# EAGLE schematic Vent Schematic (EAGLE 8.6.0)
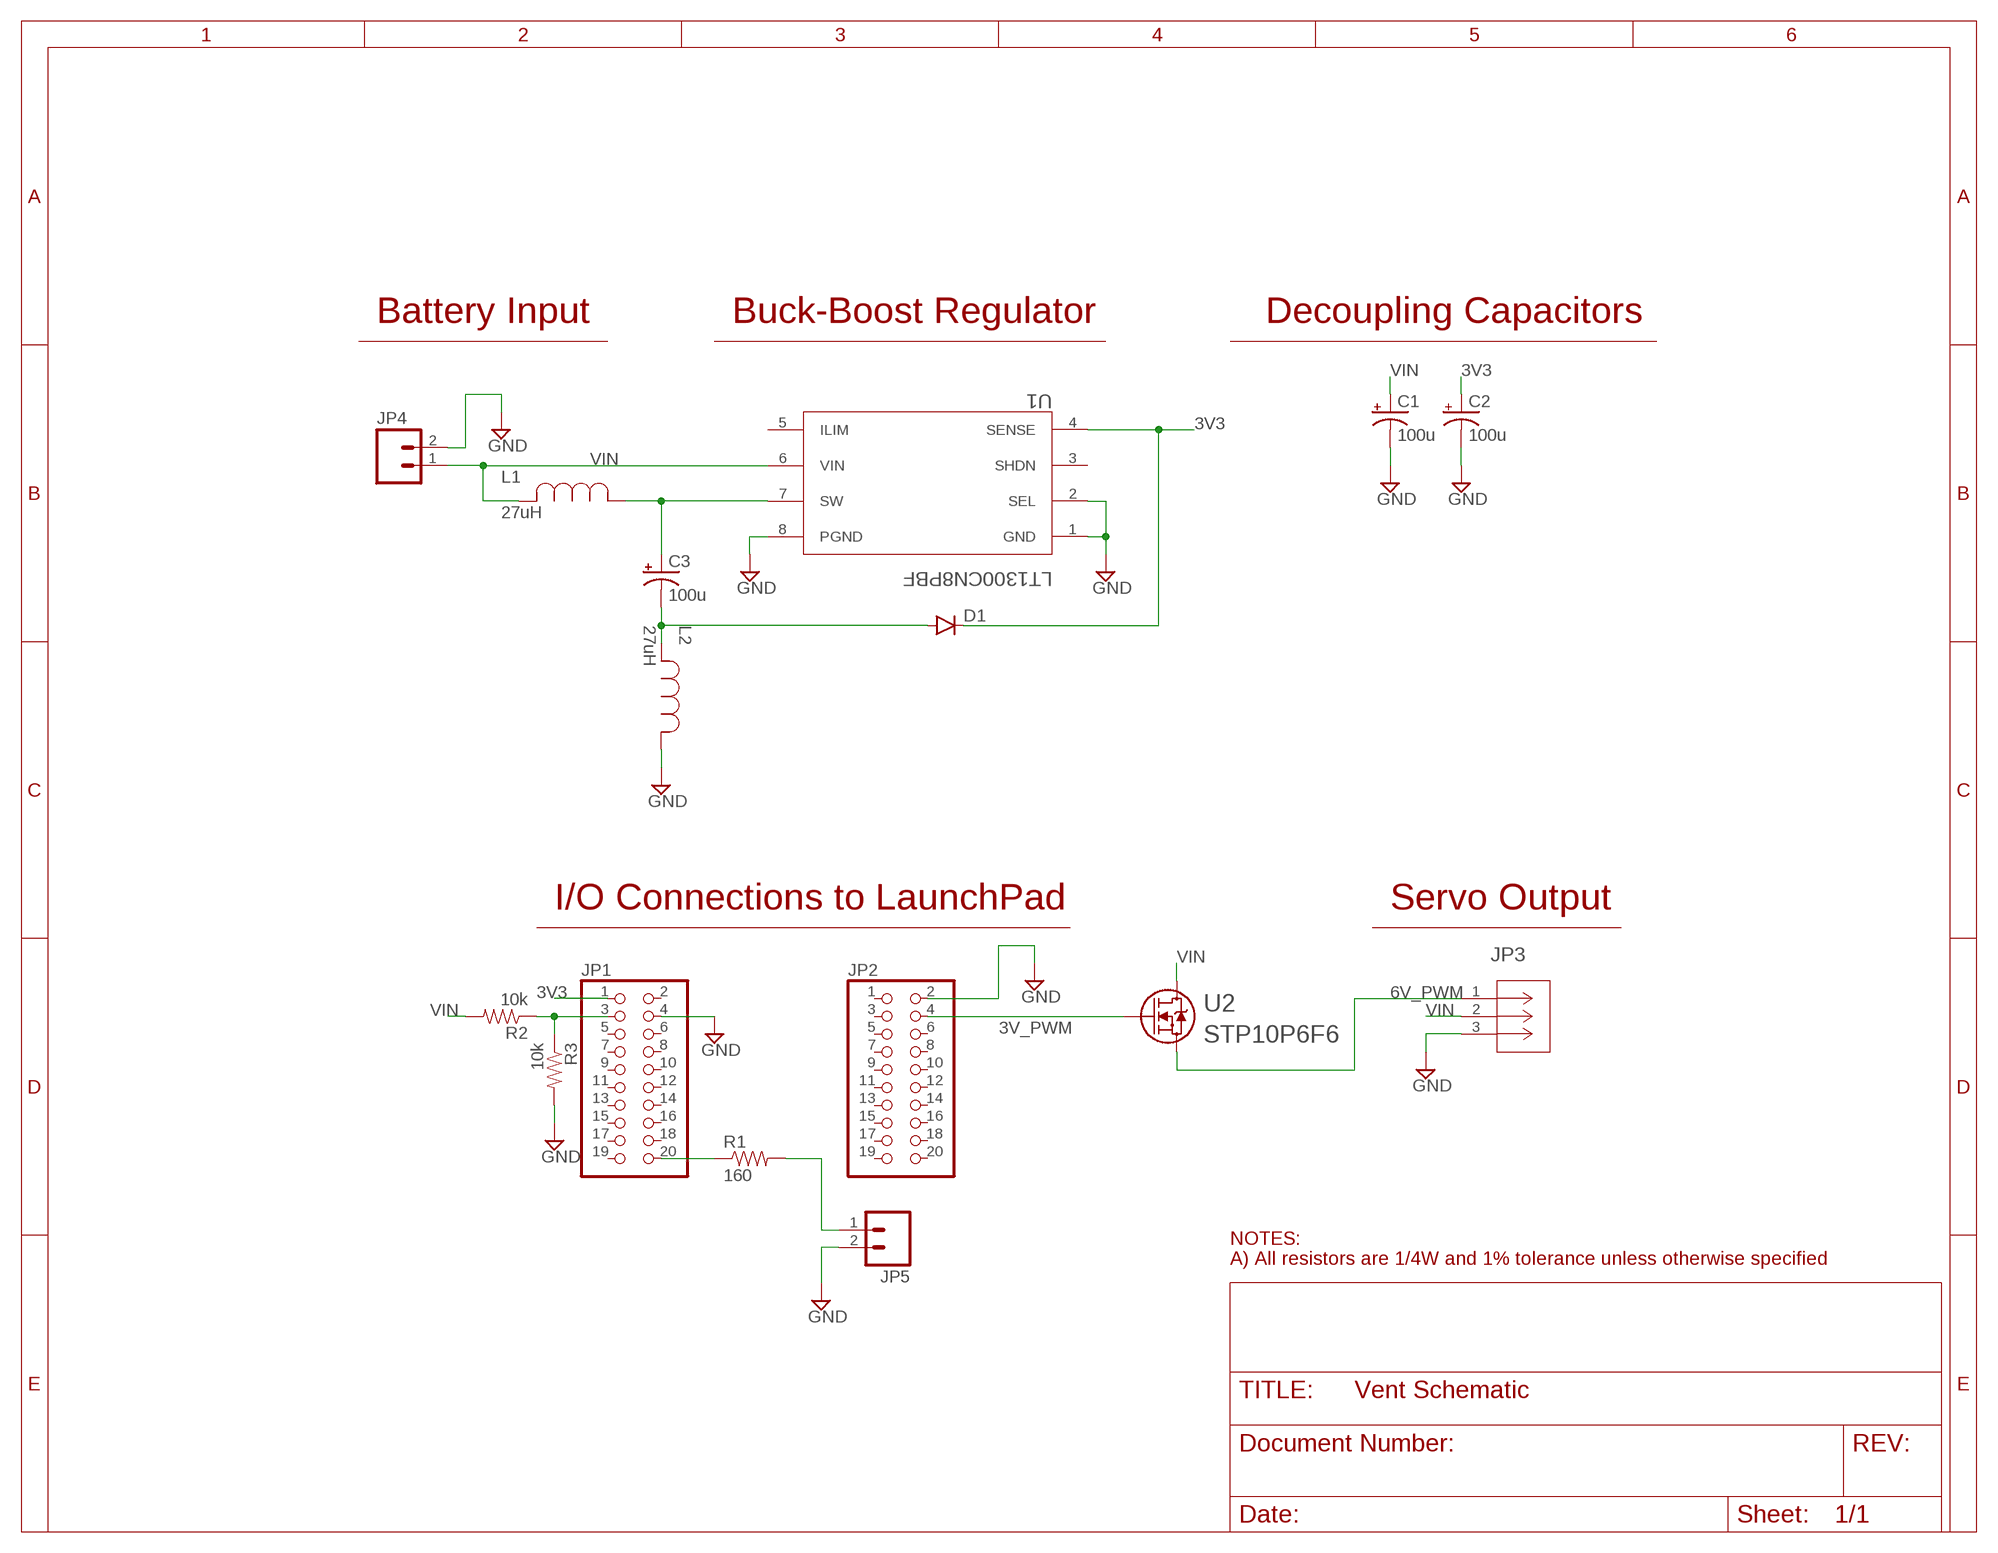
[diagram p0: schematic, sheet 1]

## Parts
C1  100u  1000UF-25V(PTH)  [CPOL-RADIAL-1000UF-25V]
C2  100u  1000UF-25V(PTH)  [CPOL-RADIAL-1000UF-25V]
C3  100u  1000UF-25V(PTH)  [CPOL-RADIAL-1000UF-25V]
D1  DIODE1N4148  [DIODE-1N4148]
JP1  PINHD-2X10  [2X10]
JP2  PINHD-2X10  [2X10]
JP3  DF3A-3P-2DS  [CON3_1X3_R_DF3]
JP4  M023.5MM  [SCREWTERMINAL-3.5MM-2]
JP5  M023.5MM  [SCREWTERMINAL-3.5MM-2]
L1  27uH  2100LL-270-H-RC  [IND_2100LL_42_H]
L2  27uH  2100LL-270-H-RC  [IND_2100LL_42_H]
R1  160  RESISTORAXIAL-0.3  [AXIAL-0.3]
R2  10k  RESISTORAXIAL-0.3  [AXIAL-0.3]
R3  10k  RESISTORAXIAL-0.3  [AXIAL-0.3]
U1  LT1300CN8PBF  [PDIP-8_N]
U2  STP10P6F6  [TO-220]

## Nets
3V3: C2.+ D1.C JP1.1 U1.4(SENSE)
3V_PWM: JP2.4 U2.1
6V_PWM: JP3.1 U2.3
GND: C1.- C2.- JP1.4 JP2.2 JP3.3 JP4.2 JP5.2 L2.1 R3.P$2 U1.1(GND) U1.2(SEL) U1.8(PGND)
N$1: JP5.1 R1.P$2
N$2: JP1.20 R1.P$1
N$3: JP1.3 R2.P$1 R3.P$1
N$4: C3.- D1.A L2.2
N$5: C3.+ L1.1 U1.7(SW)
VIN: C1.+ JP3.2 JP4.1 L1.2 R2.P$2 U1.6(VIN) U2.2
Unconnected: JP1.2 JP1.5 JP1.6 JP1.7 JP1.8 JP1.9 JP1.10 JP1.11 JP1.12 JP1.13 JP1.14 JP1.15 JP1.16 JP1.17 JP1.18 JP1.19 JP2.1 JP2.3 JP2.5 JP2.6 JP2.7 JP2.8 JP2.9 JP2.10 JP2.11 JP2.12 JP2.13 JP2.14 JP2.15 JP2.16 JP2.17 JP2.18 JP2.19 JP2.20 U1.3(SHDN) U1.5(ILIM)

## Notes on the sheet
- Battery Input | Buck-Boost Regulator | Decoupling Capacitors
- I/O Connections to LaunchPad | Servo Output
- NOTES:
  A) All resistors are 1/4W and 1% tolerance unless otherwise specified

## Library data of the parts
C1-C3 = SparkFun-Capacitors:1000UF-25V(PTH): CAP-08070; PROD_ID: CAP-09538; VALUE: CAP-09538
D1 = SparkFun-DiscreteSemi:DIODE: Diode These are standard reverse protection diodes and small signal diodes. SMA package can handle up to about 1A. SOD-323 can handle about 200mA. What the SOD-323 package when ordering, there are some mfgs out there that are 5-pin packages.
JP1 JP2 = SparkFun-Connectors:PINHD-2X10: PIN HEADER
JP3 = 3 Pin H3894-ND:DF3A-3P-2DS; MANUFACTURER_PART_NUMBER: DF3A3P2DS; VENDOR: Hirose
JP4 JP5 = SparkFun-Connectors:M02: Standard 2-pin 0.1" header. Use with - straight break away headers ( PRT-00116) - right angle break away headers (PRT-00553) - swiss pins (PRT-00743) - machine pins (PRT-00117) - female headers (PRT-00115) Molex polarized connector foot print use with: PRT-08233 with associated crimp pins and housings. 2.54_SCREWTERM for use with PRT-10571. 3.5mm Screw Terminal footprints for PRT-08084 5mm Screw Terminal footprints for use with PRT-08432; PROD_ID: CONN-08399
L1 L2 = Inductor-27uH:2100LL-270-H-RC; MANUFACTURER_PART_NUMBER: 2100LL270HRC; VENDOR: Bourns Electronics
R1-R3 = SparkFun-Passives:RESISTOR: Resistor Basic schematic elements and footprints for 0603, 1206, and PTH resistors.
U1 = LT1300 BuckBoost:LT1300CN8PBF; MANUFACTURER_PART_NUMBER: LT1300CN8#PBF; VENDOR: Linear Technology
U2 = PMOS_STP10P6F6:STP10P6F6; MANUFACTURER_PART_NUMBER: STP10P6F6; VENDOR: ST Microelectronics